# EAGLE design GaN_FET_Adapter (EAGLE 9.6.2)
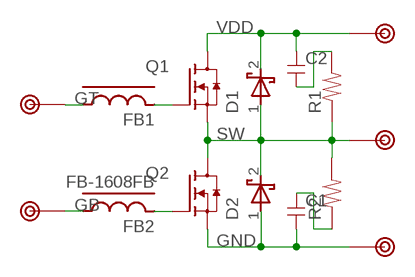
[diagram p0: schematic, sheet 1]

## Parts
C1  C-3225-2  [3225-2]
C2  C-3225-2  [3225-2]
D1  SBD-1A2  [SOD123]
D2  SBD-1A2  [SOD123]
FB1  FB-1608FB  [1608-FB]
FB2  FB-1608FB  [1608-FB]
Q1  NMOS-GAN  [PQFN8X8]
Q2  NMOS-GAN  [PQFN8X8]
R1  R-2012-2  [2012-2]
R2  R-2012-2  [2012-2]
TP1  TESTPIN-MID  [TESTPIN-MID]
TP2  TESTPIN-MID  [TESTPIN-MID]
TP3  TESTPIN-MID  [TESTPIN-MID]
TP4  TESTPIN-MID  [TESTPIN-MID]
TP5  TESTPIN-MID  [TESTPIN-MID]

## Nets
GB: FB2.1 TP4.1
GND: C1.2 D2.1(A) Q2.S TP3.1
GT: FB1.1 TP5.1
N$1: C2.2 R1.2
N$2: C1.1 R2.1
N$5: FB2.2 Q2.G
N$6: FB1.2 Q1.G
SW: D1.1(A) D2.2(K) Q1.S Q2.D R1.1 R2.2 TP2.1
VDD: C2.1 D1.2(K) Q1.D TP1.1

## Library data of the parts
C1 C2 = my_rcl:C
D1 D2 = my_rcl:SBD
FB1 FB2 = my_rcl:FB
Q1 Q2 = my_ic:NMOS
R1 R2 = my_rcl:R
TP1-TP5 = my_connector:TESTPIN

## Board
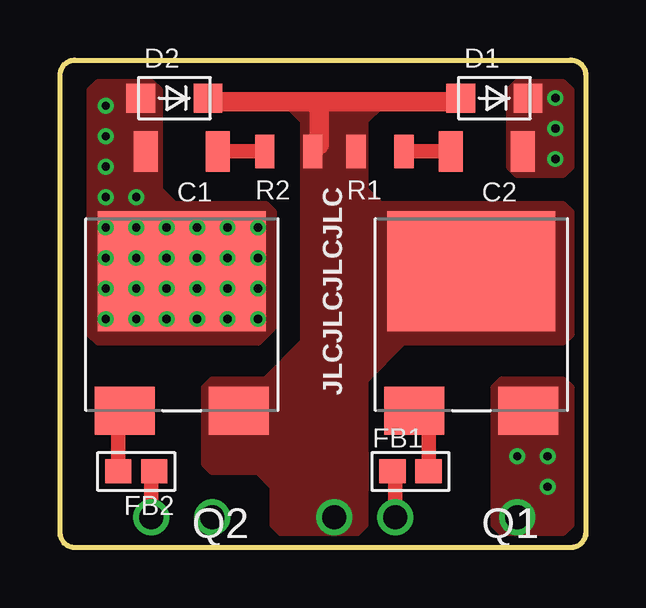
[diagram p1: board, top side]
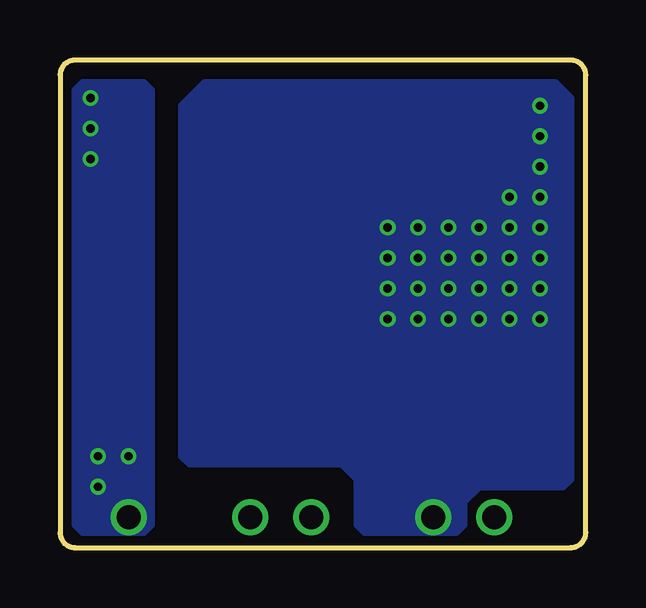
[diagram p2: board, bottom side, seen from below]

Size 21.91 x 20.32 mm. Coordinates in mm from the lower left corner, seen from the top.
Outline: 0,0.64 0,19.68 arc-90 0.64,20.32 21.27,20.32 arc-90 21.91,19.68 21.91,0.64 arc-90 21.27,0 0.64,0 arc-90 0,0.64
Copper layers (1*16): Top 0.035mm / dielectric 1.5mm / Bottom 0.035mm
Design rules "SeeedStudio_2layer_DRU_20140221": minimum track width 6mil, minimum drill 0.3mm, track to track 8mil, track to pad 8mil, pad to pad 8mil, via to via 12mil, smd to smd 0mil, copper to edge 0.3mm, drill to drill 10mil, minimum pad ring 0.15mm, minimum via ring 6mil, stop-mask expansion 2mil, vias tented up to drill 1mm, thermal gap 10mil

### Footprints (pad centres in the part's own frame; a part is rotated, then mirrored left to right if it is on the bottom)
3225-2 = smd 1 x 1.7: 1 -1.5,0; 2 1.5,0
SOD123 = smd 1.2 x 1.2: 1 -1.4,0; 2 1.4,0
1608-FB = smd 1.1 x 1: 1 -0.75,0; 2 0.75,0
PQFN8X8 = smd 2.5 x 2: D 2.375,0; G -2.375,0 | smd 7 x 5: S 0,5.8
2012-2 = smd 0.8 x 1.4: 1 -1,0; 2 1,0
TESTPIN-MID = drill 1 pad 1.3: 1 0,0

### Placement (x,y rotation side)
C1  5.08,16.51 180 top
C2  17.78,16.51 180 top
D1  18.1,18.73 0 top
D2  4.76,18.73 0 top
FB1  14.61,3.17 0 top
FB2  3.17,3.17 180 top
Q1  17.14,5.71 0 top
Q2  5.08,5.71 0 top
R1  13.34,16.51 0 top
R2  9.53,16.51 0 top
TP1  19.05,1.27 0 top
TP2  11.43,1.27 0 top
TP3  6.35,1.27 0 top
TP4  3.81,1.27 0 top
TP5  13.97,1.27 0 top

### Tracks (layer width: path | path; a pad name or v marks a point on that pad's centre or on a via)
GB
  Top 0.61: TP4.1 3.81,3.06 FB2.1
GND  (via drill 0.35)
  other vias: 1.91,13.34 3.17,13.34 4.45,13.34 5.71,13.34 6.99,13.34 8.26,13.34 8.26,12.06 6.99,12.06 5.71,12.06 4.45,12.06 3.17,12.06 1.91,12.06 1.91,10.79 3.17,10.79 4.45,10.79 5.71,10.79 6.99,10.79 8.26,10.79 8.26,9.53 6.99,9.53 5.71,9.53 4.45,9.53 3.17,9.53 1.91,9.53 3.17,14.61 1.91,14.61 1.91,15.88 1.91,17.14 1.91,18.41
  pour Bottom (isolate 0.305, no thermals): 5.4,0.64 5.08,0.95 5.08,1.91 4.45,2.54 0.95,2.54 0.64,2.86 0.64,18.73 1.27,19.37 15.88,19.37 16.83,18.41 16.83,3.81 16.51,3.49 10.16,3.49 9.53,2.86 9.53,0.95 9.21,0.64
  pour Top (isolate 0.305, no thermals): 1.59,14.29 8.57,14.29 8.89,13.97 8.89,9.21 8.26,8.57 1.59,8.57 1.27,8.89 1.27,13.97
  pour Top (isolate 0.305, no thermals): 1.27,13.97 1.27,19.05 1.59,19.37 3.81,19.37 4.13,19.05 4.13,14.92 5.08,13.97
GT
  Top 0.61: TP5.1 13.97,3.06 FB1.1
N$1
  Top 0.61: C2.2 R1.2
N$2
  Top 0.61: R2.1 C1.1
N$5
  Top 0.61: FB2.2 2.42,5.43 Q2.G
N$6
  Top 0.61: FB1.2 15.36,5.13 Q1.G
SW
  Top 0.813: D2.2 6.32,18.57 10.79,18.57 | 10.79,18.57 16.54,18.57 D1.1 | R2.2 10.79,16.78 10.79,18.57
  pour Top (isolate 0.305, no thermals): 9.21,0.64 8.89,0.95 8.89,2.54 8.26,3.17 6.35,3.17 6.03,3.49 6.03,6.67 6.35,6.99 8.57,6.99 10.16,8.57 10.16,13.02 11.43,14.29 20.95,14.29 21.27,13.97 21.27,8.89 20.95,8.57 14.29,8.57 12.7,6.99 12.7,0.95 12.38,0.64
  pour Top (isolate 0.305, no thermals): 10.16,12.7 10.16,17.78 9.53,18.41 13.34,18.41 12.7,17.78 12.7,14.92 13.34,14.29 13.34,12.7
VDD  (via drill 0.35)
  other vias: 20.64,18.73 20.64,16.19 20.64,17.46 19.05,3.81 20.32,3.81 20.32,2.54
  pour Top (isolate 0.305, no thermals): 18.1,0.95 18.1,6.67 18.41,6.99 20.95,6.99 21.27,6.67 21.27,0.95 20.95,0.64 18.41,0.64
  pour Bottom (isolate 0.305, no thermals): 18.41,0.64 20.95,0.64 21.27,0.95 21.27,19.05 20.95,19.37 18.41,19.37 18.1,19.05 18.1,0.95
  pour Top (isolate 0.305, no thermals): 18.73,19.05 18.73,15.88 19.05,15.56 20.95,15.56 21.27,15.88 21.27,19.05 20.95,19.37 19.05,19.37

### Text on the board
tPlace: JLCJLCJLCJLC